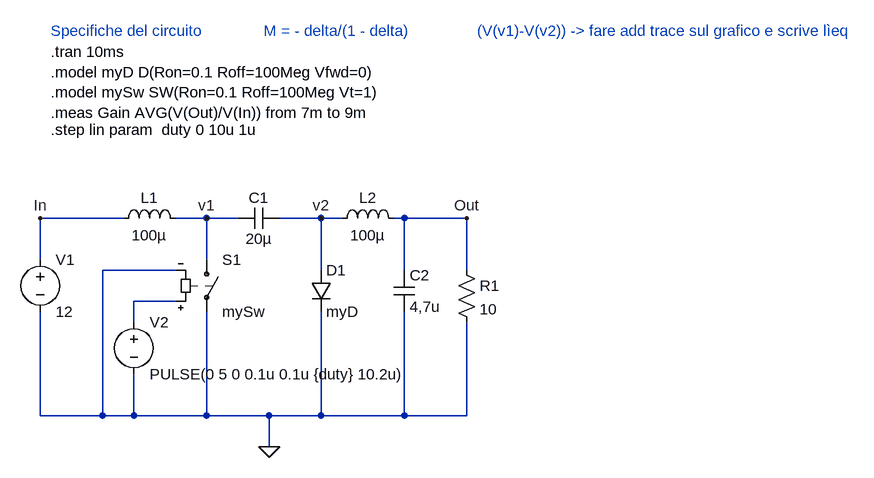
[diagram p0: schematic circuito_tesla.asc]
circuito_tesla.asc, the LTspice schematic file:
Version 4
SHEET 1 880 680
WIRE -2736 -64 -2864 -64
WIRE -2608 -64 -2656 -64
WIRE -2560 -64 -2608 -64
WIRE -2432 -64 -2496 -64
WIRE -2400 -64 -2432 -64
WIRE -2304 -64 -2320 -64
WIRE -2208 -64 -2304 -64
WIRE -2864 0 -2864 -64
WIRE -2608 0 -2608 -64
WIRE -2656 16 -2768 16
WIRE -2432 16 -2432 -64
WIRE -2304 16 -2304 -64
WIRE -2208 16 -2208 -64
WIRE -2656 64 -2720 64
WIRE -2720 96 -2720 64
WIRE -2864 240 -2864 80
WIRE -2768 240 -2768 16
WIRE -2768 240 -2864 240
WIRE -2720 240 -2720 176
WIRE -2720 240 -2768 240
WIRE -2608 240 -2608 80
WIRE -2608 240 -2720 240
WIRE -2512 240 -2608 240
WIRE -2432 240 -2432 80
WIRE -2432 240 -2512 240
WIRE -2304 240 -2304 80
WIRE -2304 240 -2432 240
WIRE -2208 240 -2208 96
WIRE -2208 240 -2304 240
WIRE -2512 288 -2512 240
FLAG -2208 -64 Out
FLAG -2864 -64 In
FLAG -2512 288 0
FLAG -2608 -64 v1
FLAG -2432 -64 v2
SYMBOL ind -2752 -48 R270
WINDOW 0 32 56 VTop 2
WINDOW 3 5 56 VBottom 2
SYMATTR InstName L1
SYMATTR Value 100µ
SYMBOL ind -2416 -48 R270
WINDOW 0 32 56 VTop 2
WINDOW 3 5 56 VBottom 2
SYMATTR InstName L2
SYMATTR Value 100µ
SYMBOL cap -2496 -80 R90
WINDOW 0 0 32 VBottom 2
WINDOW 3 32 32 VTop 2
SYMATTR InstName C1
SYMATTR Value 20µ
SYMBOL cap -2320 16 R0
SYMATTR InstName C2
SYMATTR Value 4,7u
SYMBOL res -2224 0 R0
SYMATTR InstName R1
SYMATTR Value 10
SYMBOL diode -2448 16 R0
SYMATTR InstName D1
SYMATTR Value myD
SYMBOL voltage -2864 -16 R0
SYMATTR InstName V1
SYMATTR Value 12
SYMBOL voltage -2720 80 R0
WINDOW 123 0 0 Left 0
WINDOW 39 0 0 Left 0
SYMATTR InstName V2
SYMATTR Value PULSE(0 5 0 0.1u 0.1u {duty} 10.2u)
SYMBOL sw -2608 -16 R0
SYMATTR InstName S1
SYMATTR Value mySw
TEXT -2848 -320 Left 2 !.tran 10ms\n.model myD D(Ron=0.1 Roff=100Meg Vfwd=0)\n.model mySw SW(Ron=0.1 Roff=100Meg Vt=1)\n.meas Gain AVG(V(Out)/V(In)) from 7m to 9m
TEXT -2848 -352 Left 2 ;Specifiche del circuito
TEXT -2520 -352 Left 2 ;M = - delta/(1 - delta)
TEXT -2192 -352 Left 2 ;(V(v1)-V(v2)) -> fare add trace sul grafico e scrive lìeq
TEXT -2848 -200 Left 2 !.step lin param  duty 0 10u 1u

The netlist it stands for:
* circuito_tesla.asc
L1 In v1 100µ
L2 v2 Out 100µ
C1 v2 v1 20µ
C2 Out 0 4,7u
R1 Out 0 10
D1 v2 0 myD
V1 In 0 12
V2 N001 0 PULSE(0 5 0 0.1u 0.1u {duty} 10.2u)
S1 v1 0 N001 0 mySw
.model D D
.lib standard.dio
.tran 10ms
.model myD D(Ron=0.1 Roff=100Meg Vfwd=0)
.model mySw SW(Ron=0.1 Roff=100Meg Vt=1)
.meas Gain AVG(V(Out)/V(In)) from 7m to 9m
* Specifiche del circuito
* M = - delta/(1 - delta)
* (V(v1)-V(v2)) -> fare add trace sul grafico e scrive lìeq
.step lin param  duty 0 10u 1u
.backanno
.end

* Results of the author's LTspice run, read from the files saved beside the schematic
* Operating Point (first step), zero values left out:
*   V(in) = 12 V
*   V(v1) = 12 V
*   I(L1) = 120 nA
*   I(S1) = -120 nA
*   I(V1) = -120 nA
* From the log:
*   Measurement: gain
*     step  AVG(v(out)/v(in))  FROM  TO
*        1  -0.0157031  0.007  0.009
*        2  -0.126587  0.007  0.009
*        3  -0.264224  0.007  0.009
*        4  -0.439359  0.007  0.009
*        5  -0.669339  0.007  0.009
*        6  -0.984168  0.007  0.009
*        7  -1.43328  0.007  0.009
*        8  -2.11642  0.007  0.009
*        9  -3.19661  0.007  0.009
*       10  -4.46983  0.007  0.009
*       11  -0.385915  0.007  0.009